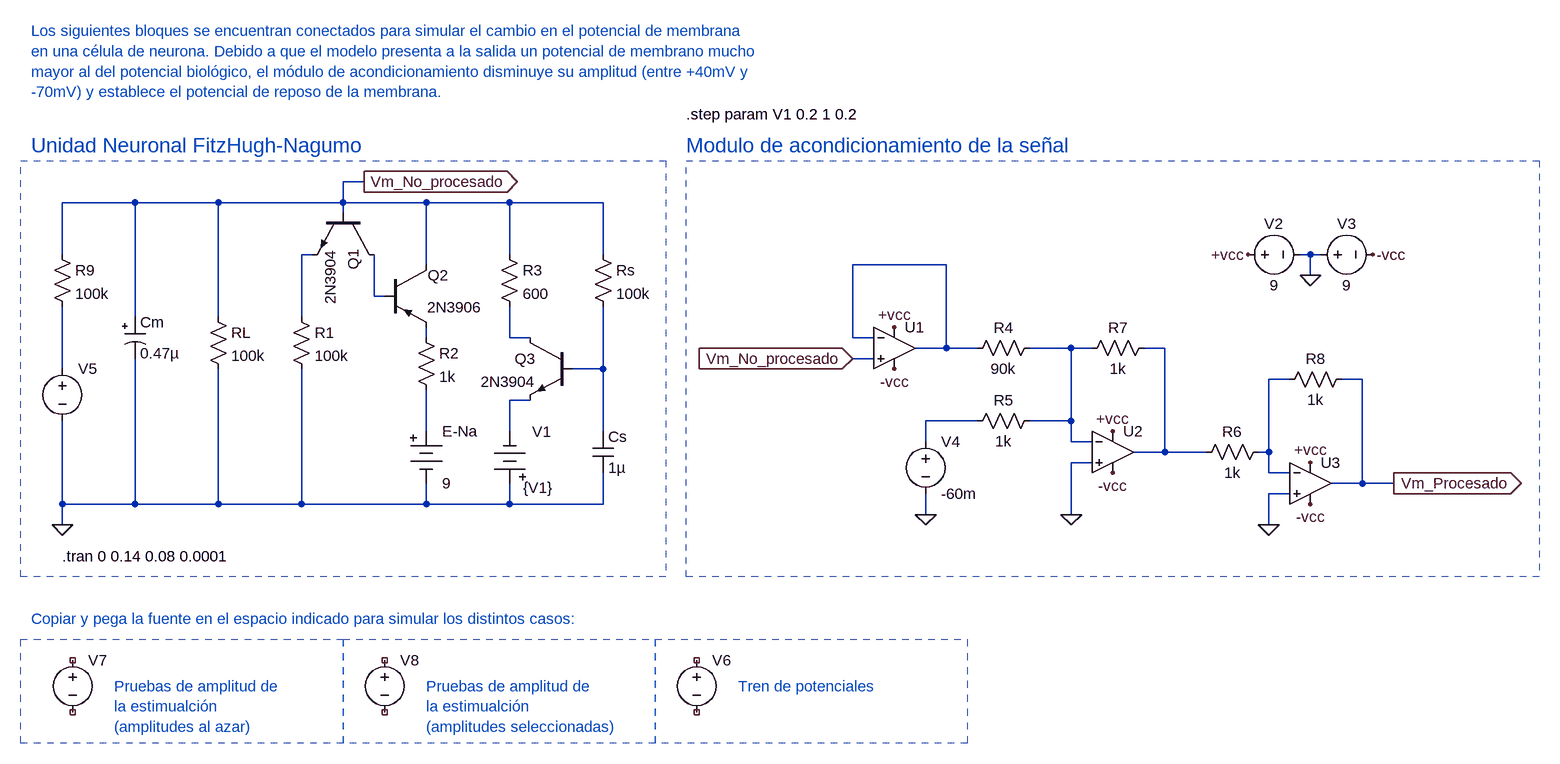
[diagram p0: schematic V1.asc]
V1.asc, the LTspice schematic file:
Version 4
SHEET 1 2272 868
WIRE 304 -224 272 -224
WIRE -48 -192 -160 -192
WIRE 80 -192 -48 -192
WIRE 272 -192 272 -224
WIRE 272 -192 80 -192
WIRE 400 -192 272 -192
WIRE 528 -192 400 -192
WIRE 672 -192 528 -192
WIRE 272 -176 272 -192
WIRE -160 -112 -160 -192
WIRE 224 -112 208 -112
WIRE 528 -112 528 -192
WIRE 672 -112 672 -192
WIRE 1760 -112 1744 -112
WIRE 1776 -112 1760 -112
WIRE 400 -96 400 -192
WIRE 1200 -96 1056 -96
WIRE 1760 -80 1760 -112
WIRE 320 -48 320 -112
WIRE 336 -48 320 -48
WIRE -48 -16 -48 -192
WIRE 80 -16 80 -192
WIRE 208 -16 208 -112
WIRE 400 16 400 0
WIRE 528 16 528 -32
WIRE 560 16 528 16
WIRE 1056 16 1056 -96
WIRE 1088 16 1056 16
WIRE 1200 32 1200 -96
WIRE 1200 32 1152 32
WIRE 1248 32 1200 32
WIRE 1392 32 1328 32
WIRE 1424 32 1392 32
WIRE 1536 32 1504 32
WIRE 1088 48 1056 48
WIRE -160 64 -160 -32
WIRE 672 64 672 -32
WIRE 672 64 624 64
WIRE 1728 80 1696 80
WIRE 1840 80 1808 80
WIRE 560 112 528 112
WIRE 1248 144 1168 144
WIRE 1392 144 1392 32
WIRE 1392 144 1328 144
WIRE 400 160 400 96
WIRE 528 160 528 112
WIRE 672 160 672 64
WIRE 1168 176 1168 144
WIRE 1392 176 1392 144
WIRE 1424 176 1392 176
WIRE 1536 192 1536 32
WIRE 1536 192 1488 192
WIRE 1600 192 1536 192
WIRE 1696 192 1696 80
WIRE 1696 192 1680 192
WIRE 1424 208 1392 208
WIRE 1696 224 1696 192
WIRE 1728 224 1696 224
WIRE 1840 240 1840 80
WIRE 1840 240 1792 240
WIRE 1888 240 1840 240
WIRE 1728 256 1696 256
WIRE -160 272 -160 144
WIRE -48 272 -48 48
WIRE -48 272 -160 272
WIRE 80 272 80 64
WIRE 80 272 -48 272
WIRE 208 272 208 64
WIRE 208 272 80 272
WIRE 400 272 400 240
WIRE 400 272 208 272
WIRE 528 272 528 240
WIRE 528 272 400 272
WIRE 672 272 672 224
WIRE 672 272 528 272
WIRE 1168 288 1168 256
WIRE 1392 288 1392 208
WIRE -160 304 -160 272
WIRE 1696 304 1696 256
FLAG -160 304 0
FLAG 1760 -80 0
FLAG 1664 -112 +vcc
FLAG 1856 -112 -vcc
FLAG 1120 0 +vcc
FLAG 1120 64 -vcc
FLAG 1392 288 0
FLAG 1168 288 0
FLAG 1456 224 -vcc
FLAG 1456 160 +vcc
FLAG 1760 272 -vcc
FLAG 1760 208 +vcc
FLAG 1696 304 0
FLAG 1888 240 Vm_Procesado
IOPIN 1888 240 Out
FLAG 1056 48 Vm_No_procesado
IOPIN 1056 48 In
FLAG 304 -224 Vm_No_procesado
IOPIN 304 -224 Out
SYMBOL res 64 -32 R0
SYMATTR InstName RL
SYMATTR Value 100k
SYMBOL res 192 -32 R0
SYMATTR InstName R1
SYMATTR Value 100k
SYMBOL res 384 0 R0
SYMATTR InstName R2
SYMATTR Value 1k
SYMBOL res 656 -128 R0
SYMATTR InstName Rs
SYMATTR Value 100k
SYMBOL cap 656 160 R0
SYMATTR InstName Cs
SYMATTR Value 1µ
SYMBOL npn 320 -176 R90
SYMATTR InstName Q1
SYMATTR Value 2N3904
SYMBOL pnp 336 -96 R0
WINDOW 0 66 16 Left 2
WINDOW 3 65 65 Left 2
SYMATTR InstName Q2
SYMATTR Value 2N3906
SYMBOL Misc\\battery 528 256 R180
WINDOW 0 -64 95 Left 2
WINDOW 3 -67 9 Left 2
WINDOW 123 0 0 Left 0
WINDOW 39 0 0 Left 0
SYMATTR InstName V1
SYMATTR Value {V1}
SYMBOL Misc\\battery 400 144 R0
WINDOW 123 0 0 Left 0
WINDOW 39 0 0 Left 0
SYMATTR InstName E-Na
SYMATTR Value 9
SYMBOL npn 624 16 M0
SYMATTR InstName Q3
SYMATTR Value 2N3904
SYMBOL polcap -64 -16 R0
SYMATTR InstName Cm
SYMATTR Value 0.47µ
SYMBOL res 512 -128 R0
SYMATTR InstName R3
SYMATTR Value 600
SYMBOL OpAmps\\UniversalOpAmp 1120 32 R0
SYMATTR InstName U1
SYMBOL OpAmps\\UniversalOpAmp 1456 192 R0
SYMATTR InstName U2
SYMBOL OpAmps\\UniversalOpAmp 1760 240 R0
SYMATTR InstName U3
SYMBOL res 1344 16 R90
WINDOW 0 0 56 VBottom 2
WINDOW 3 32 56 VTop 2
SYMATTR InstName R4
SYMATTR Value 90k
SYMBOL res 1344 128 R90
WINDOW 0 0 56 VBottom 2
WINDOW 3 32 56 VTop 2
SYMATTR InstName R5
SYMATTR Value 1k
SYMBOL res 1696 176 R90
WINDOW 0 0 56 VBottom 2
WINDOW 3 32 56 VTop 2
SYMATTR InstName R6
SYMATTR Value 1k
SYMBOL res 1520 16 R90
WINDOW 0 0 56 VBottom 2
WINDOW 3 32 56 VTop 2
SYMATTR InstName R7
SYMATTR Value 1k
SYMBOL voltage 1648 -112 R270
WINDOW 0 32 56 VTop 2
WINDOW 3 -32 56 VBottom 2
WINDOW 123 0 0 Left 0
WINDOW 39 0 0 Left 0
SYMATTR InstName V2
SYMATTR Value 9
SYMBOL voltage 1760 -112 R270
WINDOW 0 32 56 VTop 2
WINDOW 3 -32 56 VBottom 2
WINDOW 123 0 0 Left 0
WINDOW 39 0 0 Left 0
SYMATTR InstName V3
SYMATTR Value 9
SYMBOL res 1824 64 R90
WINDOW 0 0 56 VBottom 2
WINDOW 3 32 56 VTop 2
SYMATTR InstName R8
SYMATTR Value 1k
SYMBOL voltage 1168 160 R0
WINDOW 123 0 0 Left 0
WINDOW 39 0 0 Left 0
SYMATTR InstName V4
SYMATTR Value -60m
SYMBOL res -176 -128 R0
SYMATTR InstName R9
SYMATTR Value 100k
SYMBOL voltage -144 496 R0
WINDOW 123 0 0 Left 0
WINDOW 39 0 0 Left 0
WINDOW 3 24 44 Invisible 2
SYMATTR Value PWL(0 0 5m 0 5.0000001m 0.5 15m 0.5 15.000001m 0 40m 0 40.000001m 1 70m 1 70.00001m 0 130m 0 130.00001m 2 150m 2 150.00001m 0 190m 0 190.00001m 3 200m 3 200.00001m 0 240m 0 240.00001m 5 250m 5 250.00001m 0 290m 0 290.00001m 5 330m 5 330.00001m 0 350m 0 350.00001m 5 400m 5 400.00001m 0 430m 0 430.00001m 7 450m 7 450.00001m 0 480m 0 480.00001m 7 520m 7 520.00001m 0 550m 0 550.00001m 1 610m 1 610.00001m 0 700m 0 700.00001m 0.5 760m 0.5 760.00001m 0 780m 0 780.00001m 1 870.m 1 870.00001m 0)
SYMATTR InstName V7
SYMBOL voltage 336 496 R0
WINDOW 123 0 0 Left 0
WINDOW 39 0 0 Left 0
WINDOW 3 24 44 Invisible 2
SYMATTR Value PWL(0 0 5m 0 5.0000001m 0.5 15m 0.5 15.000001m 0 70m 0 70.000001m 1 80m 1 80.000001m 0 135m 0 135.000001m 2 145m 2 145.000001m 0 200m 0 200.000001m 3 210m 3 210.000001m 0 265m 0 265.000001m 4 275m 4 275.000001m 0 330m 0 330.00001m 5 340m 5 340.000001m 0)
SYMATTR InstName V8
SYMBOL voltage 816 496 R0
WINDOW 3 -35 356 Invisible 2
WINDOW 123 0 0 Left 0
WINDOW 39 0 0 Left 0
SYMATTR Value PULSE(0 5 0 1f 1f 10m 50m)
SYMATTR InstName V6
SYMBOL voltage -160 48 R0
WINDOW 3 -35 356 Invisible 2
WINDOW 123 0 0 Left 0
WINDOW 39 0 0 Left 0
SYMATTR Value PULSE(0 5 0 1f 1f 10m 100m)
SYMATTR InstName V5
TEXT -160 352 Left 2 !.tran 0 0.14 0.08 0.0001
TEXT -208 -280 Left 3 ;Unidad Neuronal FitzHugh-Nagumo
TEXT 800 -280 Left 3 ;Modulo de acondicionamiento de la señal
TEXT -208 -456 Left 2 ;Los siguientes bloques se encuentran conectados para simular el cambio en el potencial de membrana\nen una célula de neurona. Debido a que el modelo presenta a la salida un potencial de membrano mucho\nmayor al del potencial biológico, el módulo de acondicionamiento disminuye su amplitud (entre +40mV y \n-70mV) y establece el potencial de reposo de la membrana.
TEXT -80 552 Left 2 ;Pruebas de amplitud de \nla estimualción\n(amplitudes al azar)
TEXT 400 552 Left 2 ;Pruebas de amplitud de \nla estimualción\n(amplitudes seleccionadas)
TEXT -208 448 Left 2 ;Copiar y pega la fuente en el espacio indicado para simular los distintos casos:
TEXT 880 552 Left 2 ;Tren de potenciales
TEXT 800 -328 Left 2 !.step param V1 0.2 1 0.2
RECTANGLE Normal 768 384 -224 -256 2
RECTANGLE Normal 2112 384 800 -256 2
RECTANGLE Normal 272 640 -224 480 2
RECTANGLE Normal 752 640 272 480 2
RECTANGLE Normal 1232 640 752 480 2

The netlist it stands for:
* V1.asc
RL Vm_No_procesado 0 100k
R1 N001 0 100k
R2 N004 N013 1k
Rs Vm_No_procesado N009 100k
Cs N009 0 1µ
Q1 N003 Vm_No_procesado N001 0 2N3904
Q2 Vm_No_procesado N003 N004 0 2N3906
V1 0 N011 {V1}
V§E-Na N013 0 9
Q3 N005 N009 N011 0 2N3904
Cm Vm_No_procesado 0 0.47µ
R3 Vm_No_procesado N005 600
XU1 Vm_No_procesado N002 +vcc -vcc N002 level1 Avol=1Meg GBW=10Meg Vos=0 En=0 Enk=0 In=0 Ink=0 Rin=500Meg  ; pins In+ In- V+ V- OUT
XU2 0 N006 +vcc -vcc N007 level1 Avol=1Meg GBW=10Meg Vos=0 En=0 Enk=0 In=0 Ink=0 Rin=500Meg  ; pins In+ In- V+ V- OUT
XU3 0 N010 +vcc -vcc Vm_Procesado level1 Avol=1Meg GBW=10Meg Vos=0 En=0 Enk=0 In=0 Ink=0 Rin=500Meg  ; pins In+ In- V+ V- OUT
R4 N006 N002 90k
R5 N006 N012 1k
R6 N010 N007 1k
R7 N007 N006 1k
V2 +vcc 0 9
V3 0 -vcc 9
R8 Vm_Procesado N010 1k
V4 N012 0 -60m
R9 Vm_No_procesado N008 100k
V7 NC_01 NC_02 PWL(0 0 5m 0 5.0000001m 0.5 15m 0.5 15.000001m 0 40m 0 40.000001m 1 70m 1 70.00001m 0 130m 0 130.00001m 2 150m 2 150.00001m 0 190m 0 190.00001m 3 200m 3 200.00001m 0 240m 0 240.00001m 5 250m 5 250.00001m 0 290m 0 290.00001m 5 330m 5 330.00001m 0 350m 0 350.00001m 5 400m 5 400.00001m 0 430m 0 430.00001m 7 450m 7 450.00001m 0 480m 0 480.00001m 7 520m 7 520.00001m 0 550m 0 550.00001m 1 610m 1 610.00001m 0 700m 0 700.00001m 0.5 760m 0.5 760.00001m 0 780m 0 780.00001m 1 870.m 1 870.00001m 0)
V8 NC_03 NC_04 PWL(0 0 5m 0 5.0000001m 0.5 15m 0.5 15.000001m 0 70m 0 70.000001m 1 80m 1 80.000001m 0 135m 0 135.000001m 2 145m 2 145.000001m 0 200m 0 200.000001m 3 210m 3 210.000001m 0 265m 0 265.000001m 4 275m 4 275.000001m 0 330m 0 330.00001m 5 340m 5 340.000001m 0)
V6 NC_05 NC_06 PULSE(0 5 0 1f 1f 10m 50m)
V5 N008 0 PULSE(0 5 0 1f 1f 10m 100m)
.model NPN NPN
.model PNP PNP
.lib standard.bjt
.tran 0 0.14 0.08 0.0001
* Unidad Neuronal FitzHugh-Nagumo
* Modulo de acondicionamiento de la señal
* Los siguientes bloques se encuentran conectados para simular el cambio en el potencial de membrana
* en una célula de neurona. Debido a que el modelo presenta a la salida un potencial de membrano mucho
* mayor al del potencial biológico, el módulo de acondicionamiento disminuye su amplitud (entre +40mV y
* -70mV) y establece el potencial de reposo de la membrana.
* Pruebas de amplitud de
* la estimualción
* (amplitudes al azar)
* Pruebas de amplitud de
* la estimualción
* (amplitudes seleccionadas)
* Copiar y pega la fuente en el espacio indicado para simular los distintos casos:
* Tren de potenciales
.step param V1 0.2 1 0.2
.lib UniversalOpAmp1.lib
.backanno
.end